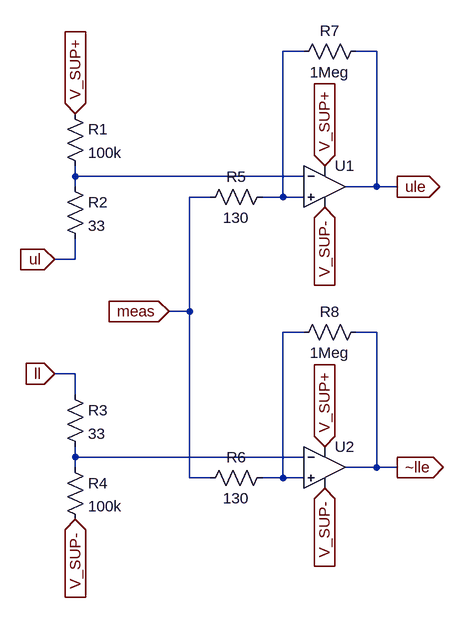
[diagram p0: schematic window-comparator.asc]
window-comparator.asc, the LTspice schematic file:
Version 4
SHEET 1 908 680
WIRE 560 -272 528 -272
WIRE 672 -272 640 -272
WIRE 208 -80 208 -96
WIRE 560 -80 208 -80
WIRE 208 -64 208 -80
WIRE 672 -64 672 -272
WIRE 672 -64 624 -64
WIRE 704 -64 672 -64
WIRE 416 -48 384 -48
WIRE 528 -48 528 -272
WIRE 528 -48 496 -48
WIRE 560 -48 528 -48
WIRE 208 48 208 16
WIRE 208 48 176 48
WIRE 384 128 384 -48
WIRE 384 128 352 128
WIRE 560 160 528 160
WIRE 672 160 640 160
WIRE 208 224 176 224
WIRE 208 256 208 224
WIRE 208 352 208 336
WIRE 560 352 208 352
WIRE 208 368 208 352
WIRE 672 368 672 160
WIRE 672 368 624 368
WIRE 704 368 672 368
WIRE 384 384 384 128
WIRE 416 384 384 384
WIRE 528 384 528 160
WIRE 528 384 496 384
WIRE 560 384 528 384
FLAG 592 -96 V_SUP+
IOPIN 592 -96 In
FLAG 592 336 V_SUP+
IOPIN 592 336 In
FLAG 592 400 V_SUP-
IOPIN 592 400 In
FLAG 592 -32 V_SUP-
IOPIN 592 -32 In
FLAG 208 -176 V_SUP+
IOPIN 208 -176 In
FLAG 208 448 V_SUP-
IOPIN 208 448 In
FLAG 176 48 ul
IOPIN 176 48 In
FLAG 176 224 ll
IOPIN 176 224 In
FLAG 352 128 meas
IOPIN 352 128 In
FLAG 704 -64 ule
IOPIN 704 -64 Out
FLAG 704 368 ~lle
IOPIN 704 368 Out
SYMBOL res 192 -192 R0
SYMATTR InstName R1
SYMATTR Value 100k
SYMBOL res 192 -80 R0
SYMATTR InstName R2
SYMATTR Value 33
SYMBOL res 192 240 R0
SYMATTR InstName R3
SYMATTR Value 33
SYMBOL res 192 352 R0
SYMATTR InstName R4
SYMATTR Value 100k
SYMBOL res 512 -64 R90
WINDOW 0 0 56 VBottom 2
WINDOW 3 32 56 VTop 2
SYMATTR InstName R5
SYMATTR Value 130
SYMBOL res 512 368 R90
WINDOW 0 0 56 VBottom 2
WINDOW 3 32 56 VTop 2
SYMATTR InstName R6
SYMATTR Value 130
SYMBOL res 656 -288 R90
WINDOW 0 0 56 VBottom 2
WINDOW 3 32 56 VTop 2
SYMATTR InstName R7
SYMATTR Value 1Meg
SYMBOL res 656 144 R90
WINDOW 0 0 56 VBottom 2
WINDOW 3 32 56 VTop 2
SYMATTR InstName R8
SYMATTR Value 1Meg
SYMBOL OpAmps\\UniversalOpAmp2 592 -64 R0
SYMATTR InstName U1
SYMATTR Value2 Avol=1Meg GBW=3.5Meg Slew=20Meg
SYMATTR SpiceLine Ilimit=60m Rail=0 Vos=0
SYMATTR SpiceLine2 En=0 Enk=0 In=0 Ink=0 Rin=500G
SYMBOL OpAmps\\UniversalOpAmp2 592 368 R0
SYMATTR InstName U2
SYMATTR Value2 Avol=1Meg GBW=3.5Meg Slew=20Meg
SYMATTR SpiceLine Ilimit=60m Rail=0 Vos=0
SYMATTR SpiceLine2 En=0 Enk=0 In=0 Ink=0 Rin=500G

The netlist it stands for:
* window-comparator.asc
R1 V_SUP+ N002 100k
R2 N002 ul 33
R3 ll N004 33
R4 N004 V_SUP- 100k
R5 N001 meas 130
R6 N003 meas 130
R7 ule N001 1Meg
R8 ~lle N003 1Meg
XU1 N001 N002 V_SUP+ V_SUP- ule level2 Avol=1Meg GBW=3.5Meg Slew=20Meg Ilimit=60m Rail=0 Vos=0 En=0 Enk=0 In=0 Ink=0 Rin=500G  ; pins In+ In- V+ V- OUT
XU2 N003 N004 V_SUP+ V_SUP- ~lle level2 Avol=1Meg GBW=3.5Meg Slew=20Meg Ilimit=60m Rail=0 Vos=0 En=0 Enk=0 In=0 Ink=0 Rin=500G  ; pins In+ In- V+ V- OUT
.lib UniversalOpAmp2.lib
.backanno
.end